# EAGLE design schematic (EAGLE 7.2.0)
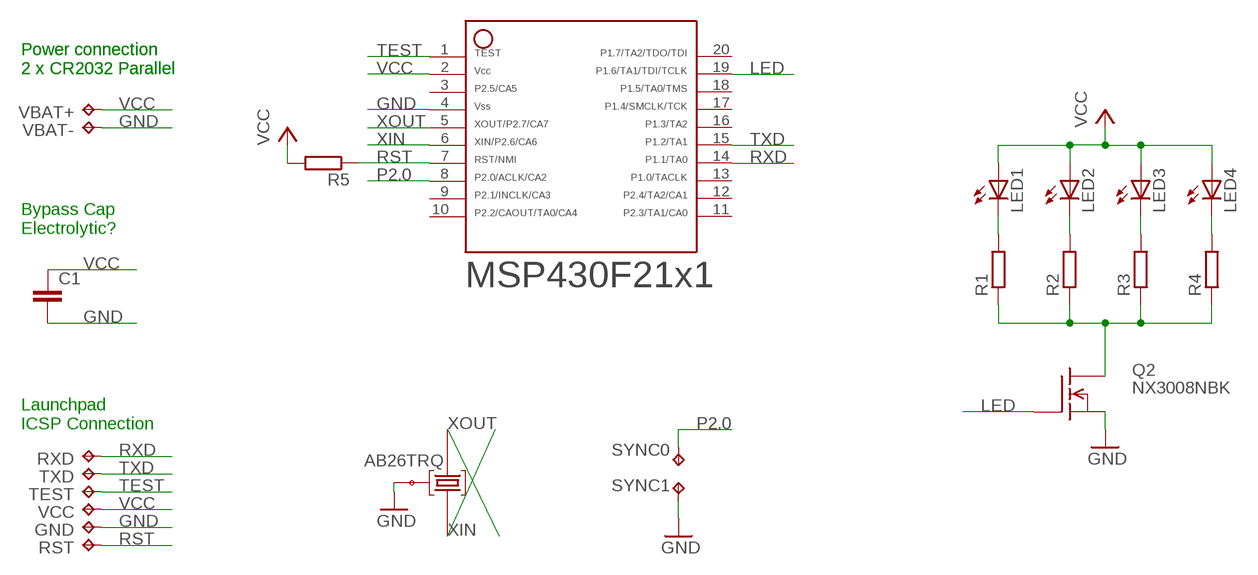
[diagram p0: schematic, sheet 1]

## Parts
C1  C-EUC0805  [C0805]
GND  TPTP15R  [TP15R]
LED1  LEDCHIP-LED0805  [CHIP-LED0805]
LED2  LEDCHIP-LED0805  [CHIP-LED0805]
LED3  LEDCHIP-LED0805  [CHIP-LED0805]
LED4  LEDCHIP-LED0805  [CHIP-LED0805]
Q2  NX3008NBK  [SOT23]
R1  R-EU_M0805  [M0805]
R2  R-EU_M0805  [M0805]
R3  R-EU_M0805  [M0805]
R4  R-EU_M0805  [M0805]
R5  R-EU_M0805  [M0805]
RST  TPTP15R  [TP15R]
RXD  TPTP15R  [TP15R]
SYNC0  TPTP15R  [TP15R]
SYNC1  TPTP15R  [TP15R]
TEST  TPTP15R  [TP15R]
TXD  TPTP15R  [TP15R]
U$1  F21X1---DW20  [DW20]
U$2  AB26TRQ  [QUARZ5]
VBAT+  TPTP15R  [TP15R]
VBAT-  TPTP15R  [TP15R]
VCC  TPTP15R  [TP15R]

## Nets
GND: C1.2 GND.TP Q2.2(S) SYNC1.TP U$1.4 U$2.GND@3 VBAT-.TP
LED: Q2.1(G)
N$4: LED1.C R1.2
N$5: LED2.C R2.2
N$6: LED3.C R3.2
N$7: LED4.C R4.2
N$8: Q2.3(D) R1.1 R2.1 R3.1 R4.1
P2.0: SYNC0.TP U$1.8
RST: R5.1 RST.TP U$1.7
RXD: RXD.TP U$1.14
TEST: TEST.TP U$1.1
TXD: TXD.TP U$1.15
VCC: C1.1 LED1.A LED2.A LED3.A LED4.A R5.2 U$1.2 VBAT+.TP VCC.TP
XIN: U$1.6 U$2.P$2
XOUT: U$1.5 U$2.P$1
Unconnected: U$1.3 U$1.9 U$1.10 U$1.11 U$1.12 U$1.13 U$1.16 U$1.17 U$1.18 U$1.19 U$1.20

## Notes on the sheet
- Power connection
  2 x CR2032 Parallel
- Power connection
  2 x CR2032 Parallel
- Bypass Cap
  Electrolytic?
- Launchpad
  ICSP Connection

## Library data of the parts
C1 = resistor:C-EU: CAPACITOR, European symbol
GND RST RXD SYNC0 SYNC1 TEST TXD VBAT+ VBAT- VCC = testpad:TP: Test pad
LED1-LED4 = led:LED: LED OSRAM: - CHIPLED LG R971, LG N971, LY N971, LG Q971, LY Q971, LO R971, LY R971 LH N974, LH R974 LS Q976, LO Q976, LY Q976 LO Q996 - Hyper CHIPLED LW Q18S LB Q993, LB Q99A, LB R99A - SideLED LS A670, LO A670, LY A670, LG A670, LP A670 LB A673, LV A673, LT A673, LW A673 LH A674 LY A675 LS A676, LA A676, LO A676, LY A676, LW A676 LS A679, LY A679, LG A679 - Hyper Micro SIDELED® LS Y876, LA Y876, LO Y876, LY Y876 LT Y87S - SmartLED LW L88C, LW L88S LB L89C, LB L89S, LG L890 LS L89K, LO L89K, LY L89K LS L896, LA L896, LO L896, LY L896 - TOPLED LS T670, LO T670, LY T670, LG T670, LP T670 LSG T670, LSP T670, LSY T670, LOP T670, LYG T670 LG T671, LOG T671, LSG T671 LB T673, LV T673, LT T673, LW T673 LH T674 LS T676, LA T676, LO T676, LY T676, LB T676, LH T676, LSB T676, LW T676 LB T67C, LV T67C, LT T67C, LS T67K, LO T67K, LY T67K, LW E67C LS E67B, LA E67B, LO E67B, LY E67B, LB E67C, LV E67C, LT E67C LW T67C LS T679, LY T679, LG T679 LS T770, LO T770, LY T770, LG T770, LP T770 LB T773, LV T773, LT T773, LW T773 LH T774 LS E675, LA E675, LY E675, LS T675 LS T776, LA T776, LO T776, LY T776, LB T776 LHGB T686 LT T68C, LB T68C - Hyper Mini TOPLED® LB M676 - Mini TOPLED Santana® LG M470 LS M47K, LO M47K, LY M47K Source: http://www.osram.convergy.de LUXEON: - LUMILED® LXK2-PW12-R00, LXK2-PW12-S00, LXK2-PW14-U00, LXK2-PW14-V00 LXK2-PM12-R00, LXK2-PM12-S00, LXK2-PM14-U00 LXK2-PE12-Q00, LXK2-PE12-R00, LXK2-PE12-S00, LXK2-PE14-T00, LXK2-PE14-U00 LXK2-PB12-K00, LXK2-PB12-L00, LXK2-PB12-M00, LXK2-PB14-N00, LXK2-PB14-P00, LXK2-PB14-Q00 LXK2-PR12-L00, LXK2-PR12-M00, LXK2-PR14-Q00, LXK2-PR14-R00 LXK2-PD12-Q00, LXK2-PD12-R00, LXK2-PD12-S00 LXK2-PH12-R00, LXK2-PH12-S00 LXK2-PL12-P00, LXK2-PL12-Q00, LXK2-PL12-R00 Source: www.luxeon.com KINGBRIGHT: KA-3528ASYC Source: www.kingbright.com
Q2 = playafly:NX3008NBK: N-Channel Enhancement Trench MOSFET 30V; 400mA; 1Ohm
R1-R5 = resistor:R-EU_: RESISTOR, European symbol
U$1 = TI_MSP430_v16:F21X1---DW20: *** MSP430F21x1 *** DW20
U$2 = playafly:AB26TRQ

## Board
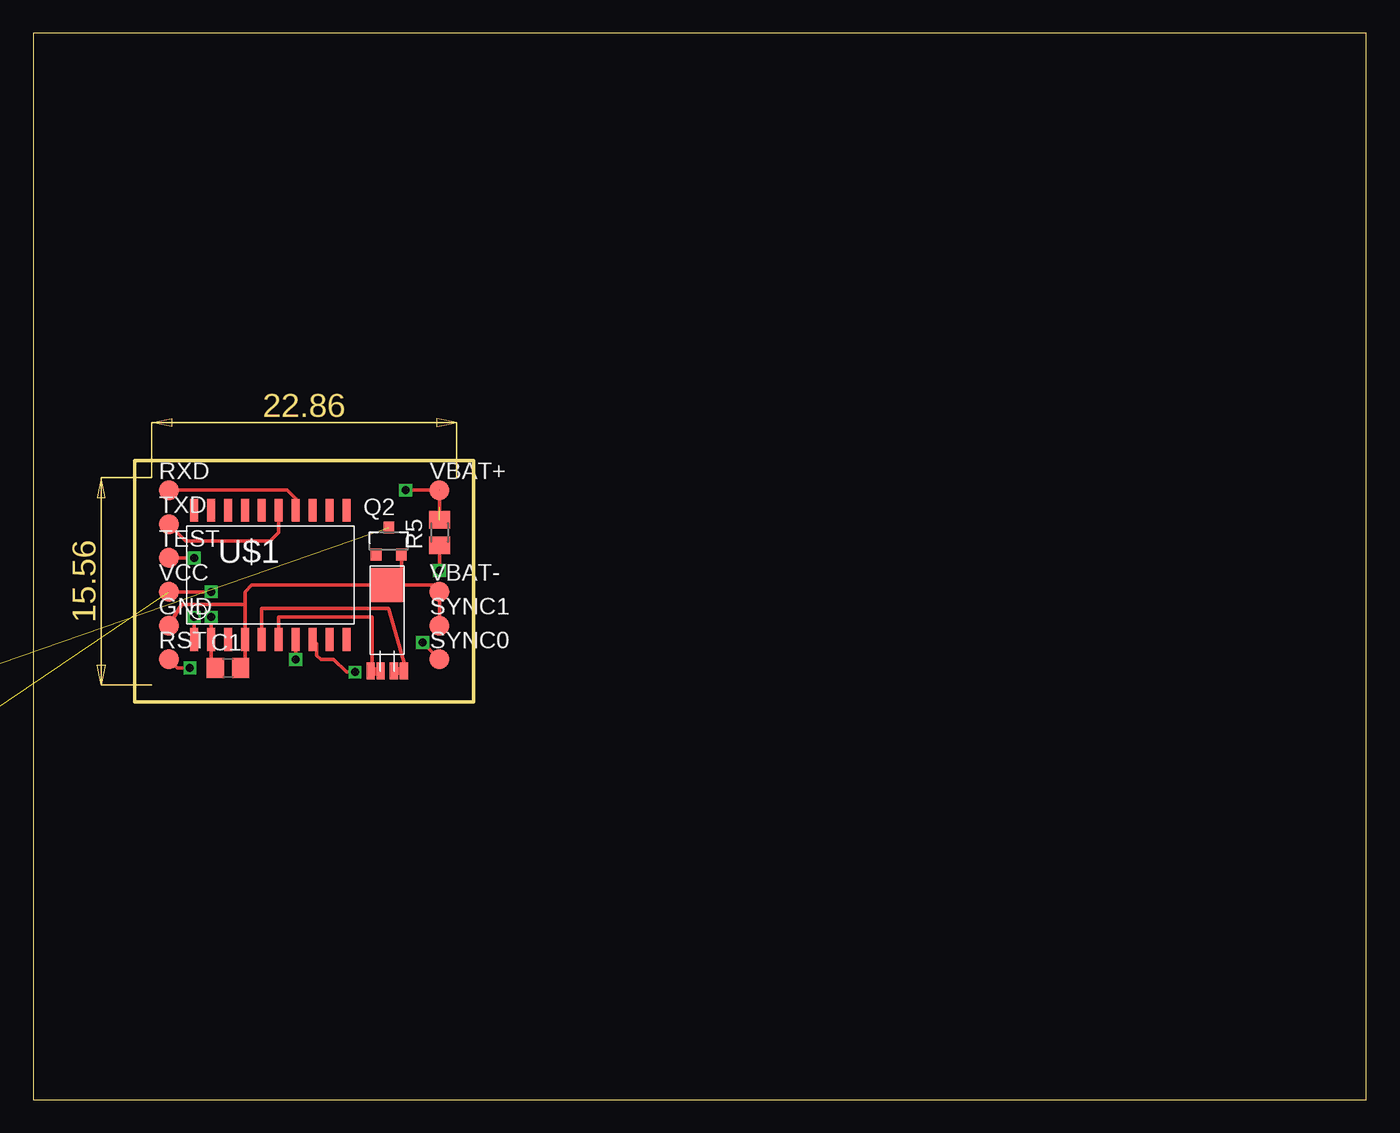
[diagram p1: board, top side]
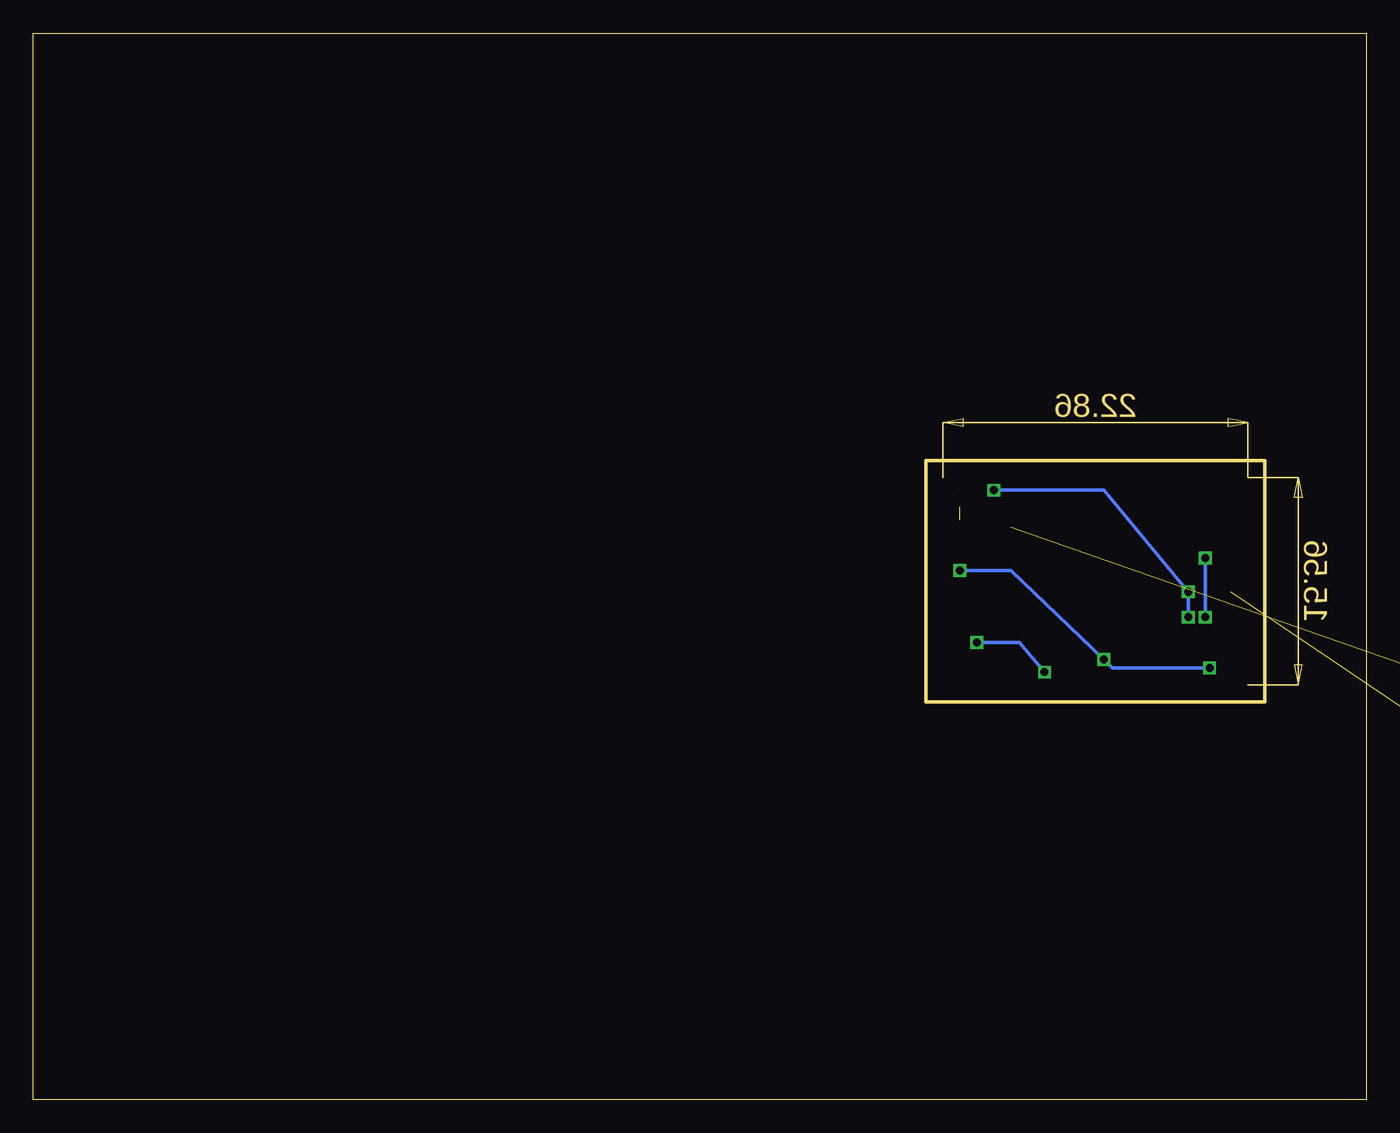
[diagram p2: board, bottom side, seen from below]

Size 100 x 80 mm. Coordinates in mm from the lower left corner, seen from the top.
Outline: 0,0 100,0 100,80 0,80 0,0
Outline: 7.62,47.94 7.62,29.84 33.02,29.84 33.02,47.94 7.62,47.94
Copper layers (1*16): Top 0.0356mm / dielectric 1.5011mm / Bottom 0.0356mm
Design rules "LaenPCBOrder": minimum track width 6mil, minimum drill 13mil, track to track 6mil, track to pad 6mil, pad to pad 6mil, via to via 6mil, smd to smd 6mil, copper to edge 15mil, drill to drill 6mil, minimum pad ring 7mil, minimum via ring 7mil, stop-mask expansion 3mil, vias tented up to drill 0mil, thermal gap 10mil

### Footprints (pad centres in the part's own frame; a part is rotated, then mirrored left to right if it is on the bottom)
C0805 = smd 1.3 x 1.5: 1 -0.95,0; 2 0.95,0
TP15R = smd 1.5 x 1.5: TP 0,0
CHIP-LED0805 = smd 1.2 x 1.2: A 0,-1.05; C 0,1.05
SOT23 = smd 0.8 x 0.9: 1 -0.95,-1; 2 0.95,-1; 3 0,1
M0805 = smd 1.3 x 1.6: 1 -0.95,0; 2 0.95,0
DW20 = smd 0.6 x 1.7: 1 -5.715,-4.85; 2 -4.445,-4.85; 3 -3.175,-4.85; 4 -1.905,-4.85; 5 -0.635,-4.85; 6 0.635,-4.85; 7 1.905,-4.85; 8 3.175,-4.85; 9 4.445,-4.85; 10 5.715,-4.85; 11 5.715,4.85; 12 4.445,4.85; 13 3.175,4.85; 14 1.905,4.85; 15 0.635,4.85; 16 -0.635,4.85; 17 -1.905,4.85; 18 -3.175,4.85; 19 -4.445,4.85; 20 -5.715,4.85
QUARZ5 = smd 1.27 x 0.635: 3 1.5,0.5; 4 1.5,-2; 5 1.5,-0.25; 6 1.5,-1.25 | smd 2.54 x 2.54: GND@3 -4.941,-0.762 | smd 0.305 x 0.152: P$1 1.27,0.635; P$2 1.27,-1.905

### Placement (x,y rotation side)
C1  14.61,32.38 0 top
GND  10.16,35.56 0 top
LED1  -25.4,13.97 0 top  (outside the outline)
LED2  -30.48,13.97 0 top  (outside the outline)
LED3  -35.56,13.97 0 top  (outside the outline)
LED4  -13.97,22.86 0 top  (outside the outline)
Q2  26.67,41.91 0 top
R1  -24.13,21.59 0 top  (outside the outline)
R2  -29.21,21.59 0 top  (outside the outline)
R3  -34.29,21.59 0 top  (outside the outline)
R4  -15.24,27.94 0 top  (outside the outline)
R5  30.48,42.55 90 top
RST  10.16,33.02 0 top
RXD  10.16,45.72 0 top
SYNC0  30.48,33.02 0 top
SYNC1  30.48,35.56 0 top
TEST  10.16,40.64 0 top
TXD  10.16,43.18 0 top
U$1  17.78,39.37 0 top
U$2  27.3,33.66 270 top
VBAT+  30.48,45.72 0 top
VBAT-  30.48,38.1 0 top
VCC  10.16,38.1 0 top

### Tracks (layer width: path | path; a pad name or v marks a point on that pad's centre or on a via)
GND
  Top 0.254: SYNC1.TP VBAT-.TP 29.98,38.6 U$2.GND@3 | 15.88,37.15 U$1.4 15.88,32.7 C1.2 | 15.88,37.15 15.88,38.1 16.37,38.6 U$2.GND@3 | GND.TP 11.11,37.15 15.88,37.15 | U$2.GND@3 27.62,39.67 Q2.2
N$4  (1 unrouted)
N$5  (1 unrouted)
N$6  (1 unrouted)
N$7  (1 unrouted)
N$8  (4 unrouted)
P2.0  (via drill 0.6)
  Top 0.254: v29.21,34.29 SYNC0.TP | U$1.8 21.27,34.2 21.27,33.34 21.59,33.02 22.54,33.02 23.5,32.07 v24.13,32.07
  Bottom 0.254: v24.13,32.07 26.04,34.29 v29.21,34.29
RST  (via drill 0.6)
  Top 0.254: U$1.7 v19.68,33.02 | v30.48,39.69 R5.1 | RST.TP 10.79,32.38 v11.75,32.38
  Bottom 0.254: v30.48,39.69 26.67,39.69 v19.68,33.02 19.05,32.38 v11.75,32.38
RXD
  Top 0.254: RXD.TP 19.05,45.72 19.68,45.09 U$1.14
TEST  (via drill 0.6)
  Top 0.254: U$1.1 v12.06,36.2 | v12.06,40.64 TEST.TP
  Bottom 0.254: v12.06,36.2 v12.06,40.64
TXD
  Top 0.254: TXD.TP 11.43,41.91 17.78,41.91 18.41,42.55 U$1.15
VCC  (via drill 0.6)  (6 unrouted)
  Top 0.254: v13.34,36.2 U$1.2 13.34,32.7 C1.1 | v13.34,38.1 VCC.TP | R5.2 VBAT+.TP v27.94,45.72
  Bottom 0.254: v13.34,36.2 v13.34,38.1 19.68,45.72 v27.94,45.72
XIN
  Top 0.254: U$2.P$2 25.4,36.2 18.41,36.2 U$1.6
XOUT
  Top 0.254: U$1.5 17.14,36.83 26.67,36.83 U$2.P$1